# EAGLE schematic midi_in (EAGLE 6.2)
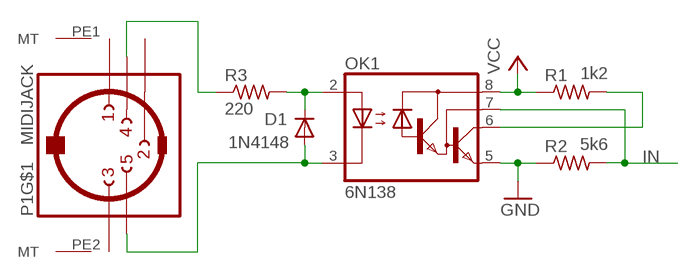
[diagram p0: schematic, sheet 1]

## Parts
D1  1N4148  1N4148DO35-7  [DO35-7]
OK1  6N138  [DIL08]
P1  MIDIJACK  [CP-2350]
R1  1k2  R-US_0204/5  [0204/5]
R2  5k6  R-US_0204/5  [0204/5]
R3  220  R-US_0204/5  [0204/5]

## Nets
GND: OK1.5(GND) R2.1
IN: OK1.7(VB) R2.2
N$1: D1.C OK1.2(A) R3.2
N$2: OK1.6(VO) R1.2
N$3: D1.A OK1.3(C) P1.5
N$4: P1.4 R3.1
VCC: OK1.8(VCC) R1.1
Unconnected: P1.1 P1.2 P1.3 P1.PE1(MT) P1.PE2(MT) P1.PE(MT) P1.PE@(MT)

## Library data of the parts
D1 = diode:1N4148: DIODE high speed (Philips)
OK1 = optocoupler:6N138: MOTOROLA OPTO COUPLER; MF: VISHAY/TELEFUNKEN; MPN: 6N138; OC_FARNELL: 9860150; OC_NEWARK: 35K5294
P1 = adafruit:MIDIJACK: DIN 5 jack also known as MIDI jack A modification of conn-hirshman:MAB5SH with two options for the grounding 'teeth'
R1-R3 = rcl:R-US_: RESISTOR, American symbol